# EAGLE design EvalBoard (EAGLE 7.4.0)
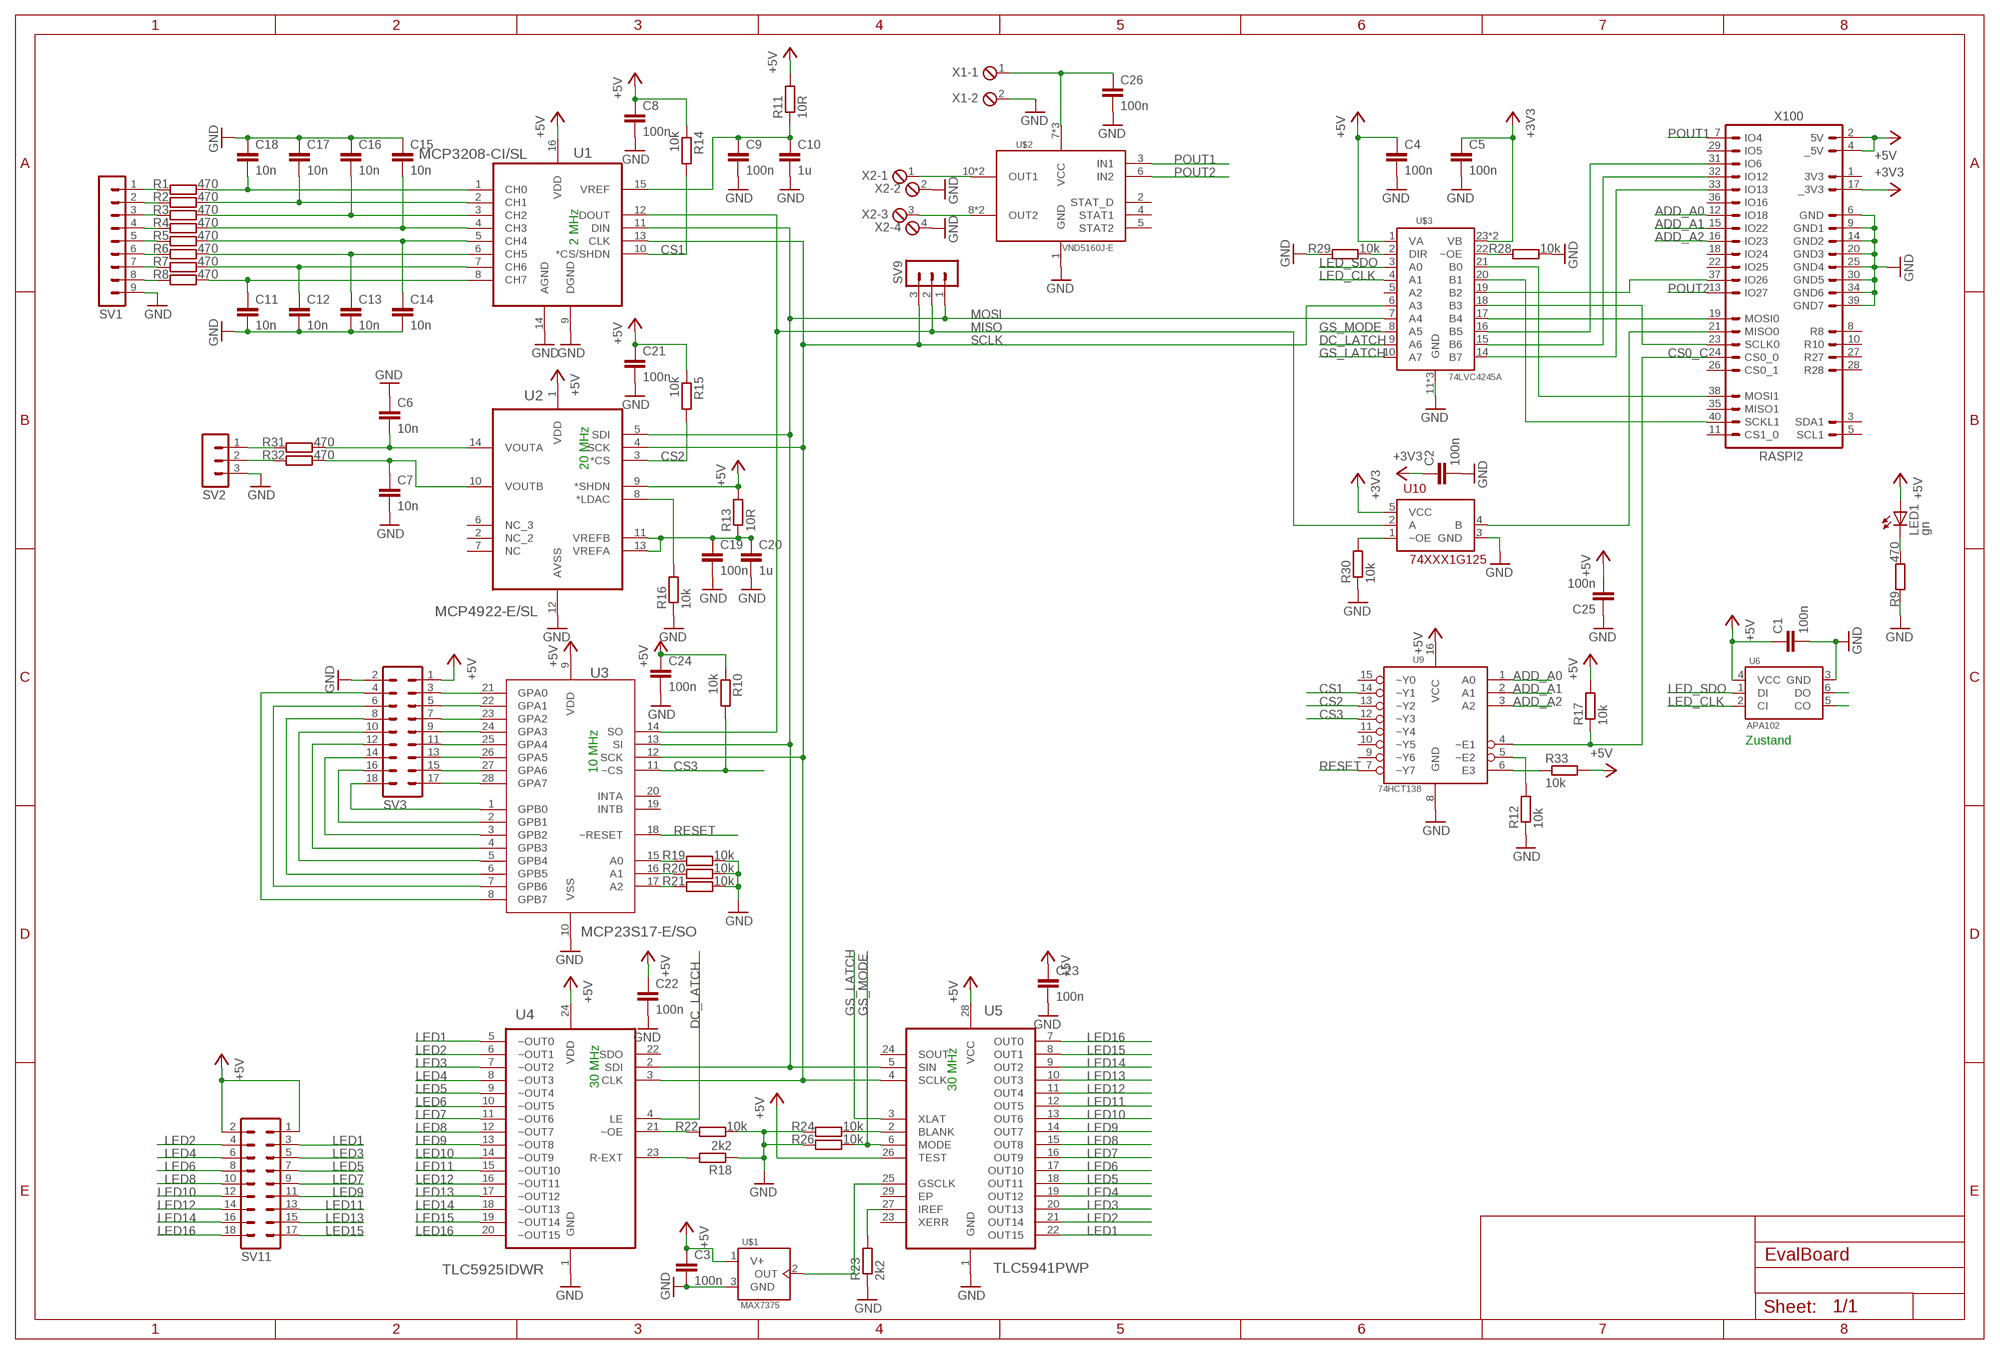
[diagram p0: schematic, sheet 1]

## Parts
C1  100n  C-EUC0805  [C0805]
C2  100n  C-EUC0805  [C0805]
C3  100n  C-EUC0805  [C0805]
C4  100n  C-EUC0805  [C0805]
C5  100n  C-EUC0805  [C0805]
C6  10n  C-EUC0805  [C0805]
C7  10n  C-EUC0805  [C0805]
C8  100n  C-EUC0805  [C0805]
C9  100n  C-EUC0805  [C0805]
C10  1u  C-EUC0805  [C0805]
C11  10n  C-EUC0805  [C0805]
C12  10n  C-EUC0805  [C0805]
C13  10n  C-EUC0805  [C0805]
C14  10n  C-EUC0805  [C0805]
C15  10n  C-EUC0805  [C0805]
C16  10n  C-EUC0805  [C0805]
C17  10n  C-EUC0805  [C0805]
C18  10n  C-EUC0805  [C0805]
C19  100n  C-EUC0805  [C0805]
C20  1u  C-EUC0805  [C0805]
C21  100n  C-EUC0805  [C0805]
C22  100n  C-EUC0805  [C0805]
C23  100n  C-EUC0805  [C0805]
C24  100n  C-EUC0805  [C0805]
C25  100n  C-EUC0805  [C0805]
C26  100n  C-EUC0805  [C0805]
LED1  gn  LED5MM  [LED5MM]
R1  470  R-EU_R0805  [R0805]
R2  470  R-EU_R0805  [R0805]
R3  470  R-EU_R0805  [R0805]
R4  470  R-EU_R0805  [R0805]
R5  470  R-EU_R0805  [R0805]
R6  470  R-EU_R0805  [R0805]
R7  470  R-EU_R0805  [R0805]
R8  470  R-EU_R0805  [R0805]
R9  470  R-EU_R0805  [R0805]
R10  10k  R-EU_R0805  [R0805]
R11  10R  R-EU_R0805  [R0805]
R12  10k  R-EU_R0805  [R0805]
R13  10R  R-EU_R0805  [R0805]
R14  10k  R-EU_R0805  [R0805]
R15  10k  R-EU_R0805  [R0805]
R16  10k  R-EU_R0805  [R0805]
R17  10k  R-EU_R0805  [R0805]
R18  2k2  R-EU_R0805  [R0805]
R19  10k  R-EU_R0805  [R0805]
R20  10k  R-EU_R0805  [R0805]
R21  10k  R-EU_R0805  [R0805]
R22  10k  R-EU_R0805  [R0805]
R23  2k2  R-EU_R0805  [R0805]
R24  10k  R-EU_R0805  [R0805]
R26  10k  R-EU_R0805  [R0805]
R28  10k  R-EU_R0805  [R0805]
R29  10k  R-EU_R0805  [R0805]
R30  10k  R-EU_R0805  [R0805]
R31  470  R-EU_R0805  [R0805]
R32  470  R-EU_R0805  [R0805]
R33  10k  R-EU_R0805  [R0805]
SV1  MA09-1W  [MA09-1W]
SV2  MA03-1  [MA03-1]
SV3  MA09-2W  [MA09-2W]
SV9  MA03-1  [MA03-1]
SV11  MA09-2W  [MA09-2W]
U1  MCP3208-CI/SL  [SOIC127P600X175-16N]
U2  MCP4922-E/SL  [SOIC127P600X175-14N]
U3  MCP23S17-E/SO  [SOIC127P030X265-28N]
U4  TLC5925IDWR  [SOIC127P1030X265-24N]
U5  TLC5941PWP  [SOP65P640X120-29N]
U6  APA102  [LED5050PACK]
U9  74HCT138  [SOIC127P600X175-16N]
U10  74XXX1G125  [SOT23-5L]
U$1  MAX7375  [SC70]
U$2  VND5160J-E  [POWERSSO12]
U$3  74LVC4245A  [SOIC127P1030X265-24N]
X1  MPT2  [2POL254]
X2  MPT4  [4POL254]
X100  RASPI2  [ML40]

## Nets
+3V3: C2.1 C5.1 U10.5(VCC) U$3.23(VB) U$3.24(VB) X100.17(_3V3)
+5V: C1.1 C3.1 C4.1 C8.1 C21.1 C22.1 C23.1 C24.1 C25.2 LED1.A R10.1 R11.2 R13.2 R14.1 R15.1 R17.2 R33.2 SV3.1 SV11.1 SV11.2 U1.16(VDD) U2.1(VDD) U2.9(*SHDN) U3.9(VDD) U4.24(VDD) U5.26(TEST) U5.28(VCC) U6.4(VCC) U9.16(VCC) U$1.1(V+) U$3.1(VA) X100.2(5V) X100.4(_5V)
ADD_A0: U9.1(A0) X100.12(IO18)
ADD_A1: U9.2(A1) X100.15(IO22)
ADD_A2: U9.3(A2) X100.16(IO23)
CS0_C: R17.1 U9.4(~E1) X100.24(CS0_0)
CS1: R14.2 U1.10(*CS/SHDN) U9.14(~Y1)
CS2: R15.2 U2.3(*CS) U9.13(~Y2)
CS3: R10.2 U3.11(~CS) U9.12(~Y3)
DC_LATCH: U4.4(LE) U$3.9(A6)
GND: C1.2 C2.2 C3.2 C4.2 C5.2 C6.1 C7.2 C8.2 C9.2 C10.2 C11.2 C12.2 C13.2 C14.2 C15.1 C16.1 C17.1 C18.1 C19.2 C20.2 C21.2 C22.2 C23.2 C24.2 C25.1 C26.2 R9.1 R12.1 R16.1 R18.1 R19.2 R20.2 R21.2 R22.2 R23.1 R24.1 R26.1 R28.2 R29.1 R30.1 SV1.9 SV2.3 SV3.2 U1.9(DGND) U1.14(AGND) U2.12(AVSS) U3.10(VSS) U4.1(GND) U5.1(GND) U6.3(GND) U9.8(GND) U10.3(GND) U$1.3(GND) U$2.1(GND) U$3.11(GND) U$3.12(GND) U$3.13(GND) X1.2 X2.2 X2.4 X100.6(GND) X100.9(GND1) X100.14(GND2) X100.20(GND3) X100.25(GND4) X100.30(GND5) X100.34(GND6) X100.39(GND7)
GS_LATCH: U5.3(XLAT) U$3.10(A7)
GS_MODE: R26.2 U5.6(MODE) U$3.8(A5)
LED1: SV11.3 U4.5(~OUT0) U5.22(OUT15)
LED2: SV11.4 U4.6(~OUT1) U5.21(OUT14)
LED3: SV11.5 U4.7(~OUT2) U5.20(OUT13)
LED4: SV11.6 U4.8(~OUT3) U5.19(OUT12)
LED5: SV11.7 U4.9(~OUT4) U5.18(OUT11)
LED6: SV11.8 U4.10(~OUT5) U5.17(OUT10)
LED7: SV11.9 U4.11(~OUT6) U5.16(OUT9)
LED8: SV11.10 U4.12(~OUT7) U5.15(OUT8)
LED9: SV11.11 U4.13(~OUT8) U5.14(OUT7)
LED10: SV11.12 U4.14(~OUT9) U5.13(OUT6)
LED11: SV11.13 U4.15(~OUT10) U5.12(OUT5)
LED12: SV11.14 U4.16(~OUT11) U5.11(OUT4)
LED13: SV11.15 U4.17(~OUT12) U5.10(OUT3)
LED14: SV11.16 U4.18(~OUT13) U5.9(OUT2)
LED15: SV11.17 U4.19(~OUT14) U5.8(OUT1)
LED16: SV11.18 U4.20(~OUT15) U5.7(OUT0)
LED_CLK: U6.2(CI) U$3.4(A1)
LED_SDO: U6.1(DI) U$3.3(A0)
MISO: SV9.2 U1.12(DOUT) U3.14(SO) U10.2(A)
MISO0: U10.4(B) X100.21(MISO0)
MOSI: SV9.1 U1.11(DIN) U2.5(SDI) U3.13(SI) U4.2(SDI) U5.5(SIN) U$3.7(A4)
MOSI0: U$3.17(B4) X100.19(MOSI0)
MOSI1: U$3.21(B0) X100.38(MOSI1)
N$1: R1.1 SV1.1
N$2: R2.1 SV1.2
N$3: R3.1 SV1.3
N$4: R4.1 SV1.4
N$5: R5.1 SV1.5
N$6: R6.1 SV1.6
N$7: R7.1 SV1.7
N$8: R8.1 SV1.8
N$9: C18.2 R1.2 U1.1(CH0)
N$10: C17.2 R2.2 U1.2(CH1)
N$11: C16.2 R3.2 U1.3(CH2)
N$12: C15.2 R4.2 U1.4(CH3)
N$13: C14.1 R5.2 U1.5(CH4)
N$14: C13.1 R6.2 U1.6(CH5)
N$15: C12.1 R7.2 U1.7(CH6)
N$16: C11.1 R8.2 U1.8(CH7)
N$17: C6.2 R31.2 U2.14(VOUTA)
N$18: R33.1 U9.6(E3)
N$35: R30.2 U10.1(~OE)
N$36: U$3.19(B2) X100.37(IO26)
N$37: R31.1 SV2.1
N$38: R32.1 SV2.2
N$39: C7.1 R32.2 U2.10(VOUTB)
N$42: U$3.16(B5) X100.31(IO6)
N$43: LED1.K(C) R9.2
N$44: U$2.8(OUT2) U$2.9(OUT2) X2.3
N$67: U$2.10(OUT1) U$2.11(OUT1) X2.1
N$72: U6.6(DO)
N$73: U6.5(CO)
N$76: C9.1 C10.1 R11.1 U1.15(VREF)
N$77: C19.1 C20.1 R13.1 U2.11(VREFB) U2.13(VREFA)
N$78: R16.2 U2.8(*LDAC)
N$80: R18.2 U4.23(R-EXT)
N$81: U5.25(GSCLK) U$1.2(OUT)
N$82: U$3.15(B6) X100.32(IO12)
N$83: R19.1 U3.15(A0)
N$84: R20.1 U3.16(A1)
N$85: R21.1 U3.17(A2)
N$86: U$3.14(B7) X100.33(IO13)
N$89: R22.1 U4.21(~OE)
N$90: R12.2 U9.5(~E2)
N$93: R23.2 U5.27(IREF)
N$94: R24.2 U5.2(BLANK)
N$98: R28.1 U$3.22(~OE)
N$99: R29.2 U$3.2(DIR)
PA0: SV3.3 U3.21(GPA0)
PA1: SV3.5 U3.22(GPA1)
PA2: SV3.7 U3.23(GPA2)
PA3: SV3.9 U3.24(GPA3)
PA4: SV3.11 U3.25(GPA4)
PA5: SV3.13 U3.26(GPA5)
PA6: SV3.15 U3.27(GPA6)
PA7: SV3.17 U3.28(GPA7)
PB0: SV3.18 U3.1(GPB0)
PB1: SV3.16 U3.2(GPB1)
PB2: SV3.14 U3.3(GPB2)
PB3: SV3.12 U3.4(GPB3)
PB4: SV3.10 U3.5(GPB4)
PB5: SV3.8 U3.6(GPB5)
PB6: SV3.6 U3.7(GPB6)
PB7: SV3.4 U3.8(GPB7)
POUT1: U$2.3(IN1) X100.7(IO4)
POUT2: U$2.6(IN2) X100.13(IO27)
RESET: U3.18(~RESET) U9.7(~Y7)
SCLK: SV9.3 U1.13(CLK) U2.4(SCK) U3.12(SCK) U4.3(CLK) U5.4(SCLK) U$3.6(A3)
SCLK0: U$3.18(B3) X100.23(SCLK0)
SCLK1: U$3.20(B1) X100.40(SCKL1)
VCC: C26.1 U$2.7(VCC) U$2.12(VCC) U$2.TP(VCC) X1.1
Unconnected: U2.2(NC_2) U2.6(NC_3) U2.7(NC) U3.19(INTB) U3.20(INTA) U4.22(SDO) U5.23(XERR) U5.24(SOUT) U5.29(EP) U9.9(~Y6) U9.10(~Y5) U9.11(~Y4) U9.15(~Y0) U$2.2(STAT_D) U$2.4(STAT1) U$2.5(STAT2) U$3.5(A2) X100.1(3V3) X100.3(SDA1) X100.5(SCL1) X100.8(R8) X100.10(R10) X100.11(CS1_0) X100.18(IO24) X100.22(IO25) X100.26(CS0_1) X100.27(R27) X100.28(R28) X100.29(IO5) X100.35(MISO1) X100.36(IO16)

## Notes on the sheet
- 2 MHz
- 20 MHz
- Zustand
- 10 MHz
- 30 MHz
- 30 MHz

## Library data of the parts
C1-C26 = rcl:C-EU: CAPACITOR, European symbol
LED1 = led:LED: LED OSRAM: - CHIPLED LG R971, LG N971, LY N971, LG Q971, LY Q971, LO R971, LY R971 LH N974, LH R974 LS Q976, LO Q976, LY Q976 LO Q996 - Hyper CHIPLED LW Q18S LB Q993, LB Q99A, LB R99A - SideLED LS A670, LO A670, LY A670, LG A670, LP A670 LB A673, LV A673, LT A673, LW A673 LH A674 LY A675 LS A676, LA A676, LO A676, LY A676, LW A676 LS A679, LY A679, LG A679 - Hyper Micro SIDELED® LS Y876, LA Y876, LO Y876, LY Y876 LT Y87S - SmartLED LW L88C, LW L88S LB L89C, LB L89S, LG L890 LS L89K, LO L89K, LY L89K LS L896, LA L896, LO L896, LY L896 - TOPLED LS T670, LO T670, LY T670, LG T670, LP T670 LSG T670, LSP T670, LSY T670, LOP T670, LYG T670 LG T671, LOG T671, LSG T671 LB T673, LV T673, LT T673, LW T673 LH T674 LS T676, LA T676, LO T676, LY T676, LB T676, LH T676, LSB T676, LW T676 LB T67C, LV T67C, LT T67C, LS T67K, LO T67K, LY T67K, LW E67C LS E67B, LA E67B, LO E67B, LY E67B, LB E67C, LV E67C, LT E67C LW T67C LS T679, LY T679, LG T679 LS T770, LO T770, LY T770, LG T770, LP T770 LB T773, LV T773, LT T773, LW T773 LH T774 LS E675, LA E675, LY E675, LS T675 LS T776, LA T776, LO T776, LY T776, LB T776 LHGB T686 LT T68C, LB T68C - Hyper Mini TOPLED® LB M676 - Mini TOPLED Santana® LG M470 LS M47K, LO M47K, LY M47K Source: http://www.osram.convergy.de LUXEON: - LUMILED® LXK2-PW12-R00, LXK2-PW12-S00, LXK2-PW14-U00, LXK2-PW14-V00 LXK2-PM12-R00, LXK2-PM12-S00, LXK2-PM14-U00 LXK2-PE12-Q00, LXK2-PE12-R00, LXK2-PE12-S00, LXK2-PE14-T00, LXK2-PE14-U00 LXK2-PB12-K00, LXK2-PB12-L00, LXK2-PB12-M00, LXK2-PB14-N00, LXK2-PB14-P00, LXK2-PB14-Q00 LXK2-PR12-L00, LXK2-PR12-M00, LXK2-PR14-Q00, LXK2-PR14-R00 LXK2-PD12-Q00, LXK2-PD12-R00, LXK2-PD12-S00 LXK2-PH12-R00, LXK2-PH12-S00 LXK2-PL12-P00, LXK2-PL12-Q00, LXK2-PL12-R00 Source: www.luxeon.com KINGBRIGHT: KA-3528ASYC Source: www.kingbright.com
R1-R24 R26 R28-R33 = rcl:R-EU_: RESISTOR, European symbol
SV1 = con-lstb:MA09-1W: PIN HEADER; OC_FARNELL: unknown; OC_NEWARK: unknown
SV2 SV9 = con-lstb:MA03-1: PIN HEADER; OC_FARNELL: unknown; OC_NEWARK: unknown
SV3 SV11 = con-lstb:MA09-2W: PIN HEADER; OC_FARNELL: unknown; OC_NEWARK: unknown
U1 = Z_GessIOMod:MCP3208-CI/SL: IC, 12 ADC, SMD, 3208; MPN: MCP3208-CI/SL; OC_FARNELL: 1084270; OC_NEWARK: 69K7605; PACKAGE: SOIC16; SUPPLIER: Microchip
U2 = Z_GessIOMod:MCP4922-E/SL: IC, 12BIT DAC DUAL, SPI I/F; MPN: MCP4922-E/SL; OC_FARNELL: 1332114; OC_NEWARK: 08J8748; PACKAGE: SOIC14; SUPPLIER: Microchip
U3 = Z_GessIOMod:MCP23S17-E/SO: 16-Bit I/O Expander; DESCRIPTION: IC I/O EXPANDER; MPN: MCP23S17-E/SO; OC_FARNELL: 1332093; OC_NEWARK: 31K2950; PACKAGE: SOIC-28; SUPPLIER: Microchip
U4 = Z_GessIOMod:TLC5925IDWR: LOW-POWER 16-CHANNEL CONSTANT-CURRENT LED SINK DRIVER; MPN: TLC5925IDWR; OC_FARNELL: 1858096; OC_NEWARK: 10R6961; PACKAGE: SOIC-24; SUPPLIER: Texas Instruments
U5 = Z_GessIOMod:TLC5941PWP: 16-CHANNEL LED DRIVER WITH DOT CORRECTION AND GRAYSCALE PWM CONTROL; MPN: TLC5941PWP; OC_FARNELL: 1226308; OC_NEWARK: 58K6744; PACKAGE: HTSSOP-28; SUPPLIER: Texas Instruments
U6 = Z_GessIOMod:APA102
U9 = Z_GessIOMod:74HCT138
U10 = Z_GessIOMod:74XXX1G125
U$1 = Z_GessIOMod:MAX7375
U$2 = Z_GessIOMod:VND5160J-E
U$3 = Z_GessIOMod:74LVC4245A
X1 = con-phoenix-254:MPT2: PHOENIX CONNECTOR; OC_FARNELL: unknown; OC_NEWARK: unknown
X2 = con-phoenix-254:MPT4: PHOENIX CONNECTOR; OC_FARNELL: unknown; OC_NEWARK: unknown
X100 = Z_GessIOMod:RASPI2

## Board
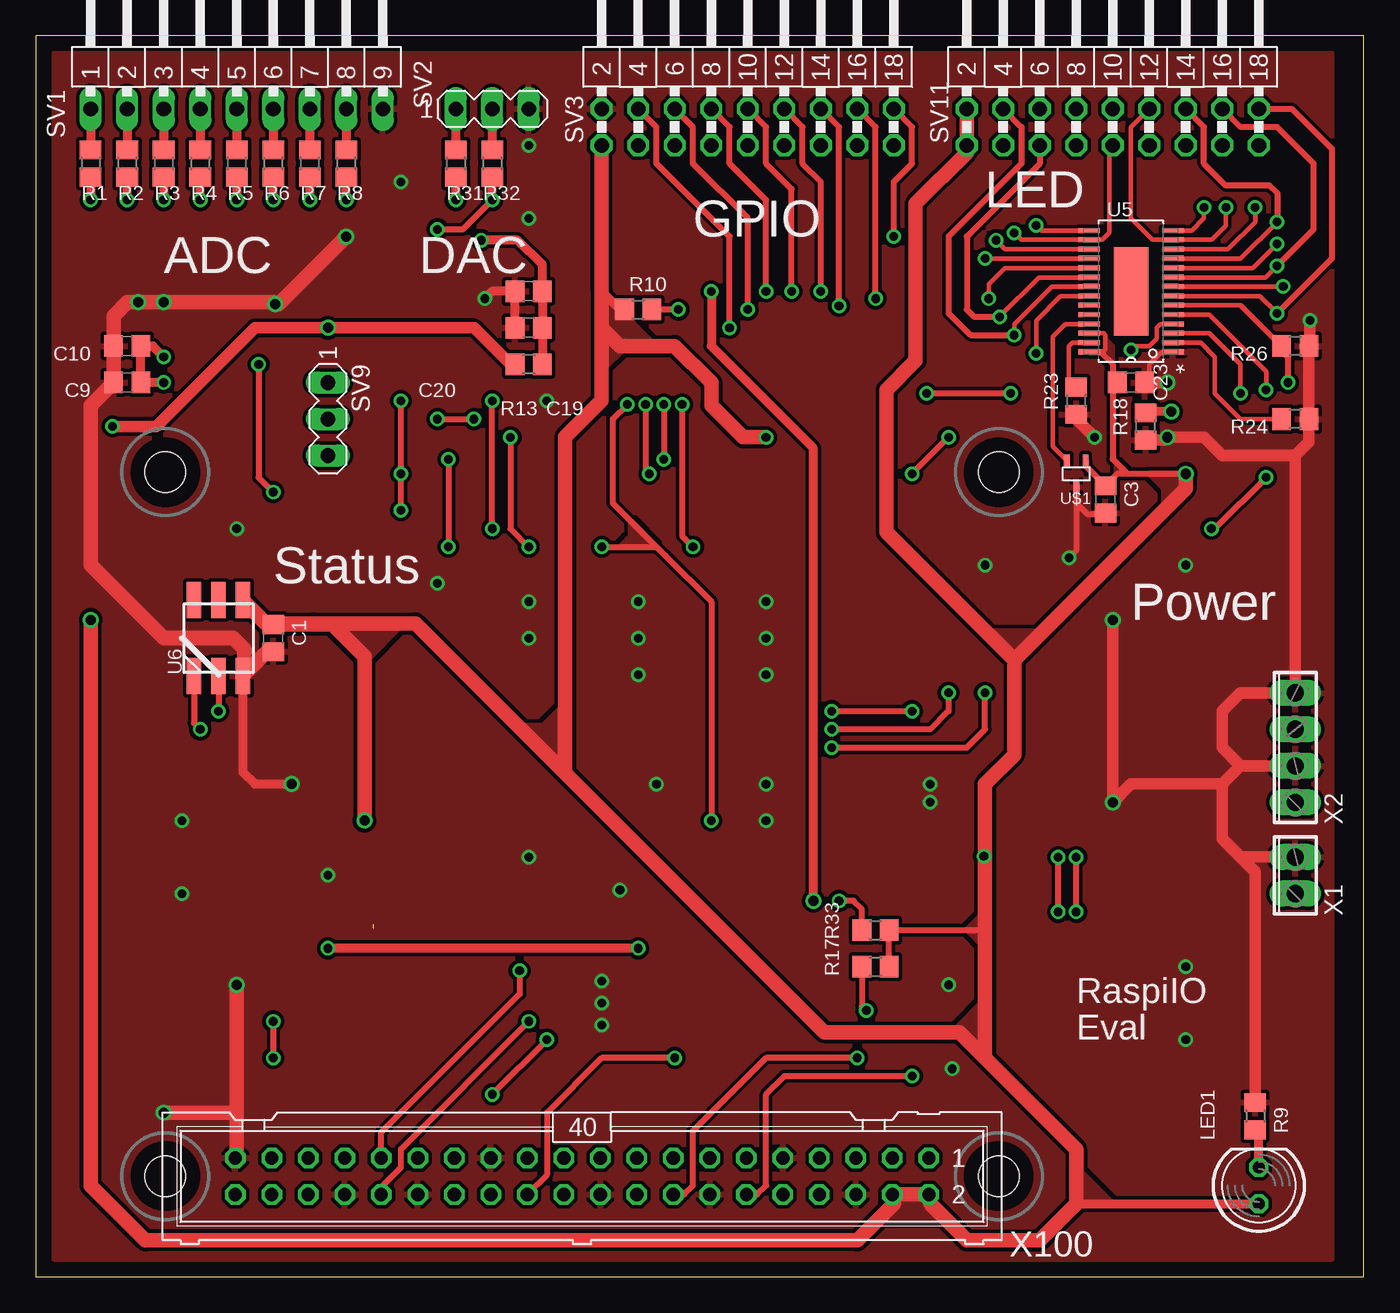
[diagram p1: board, top side]
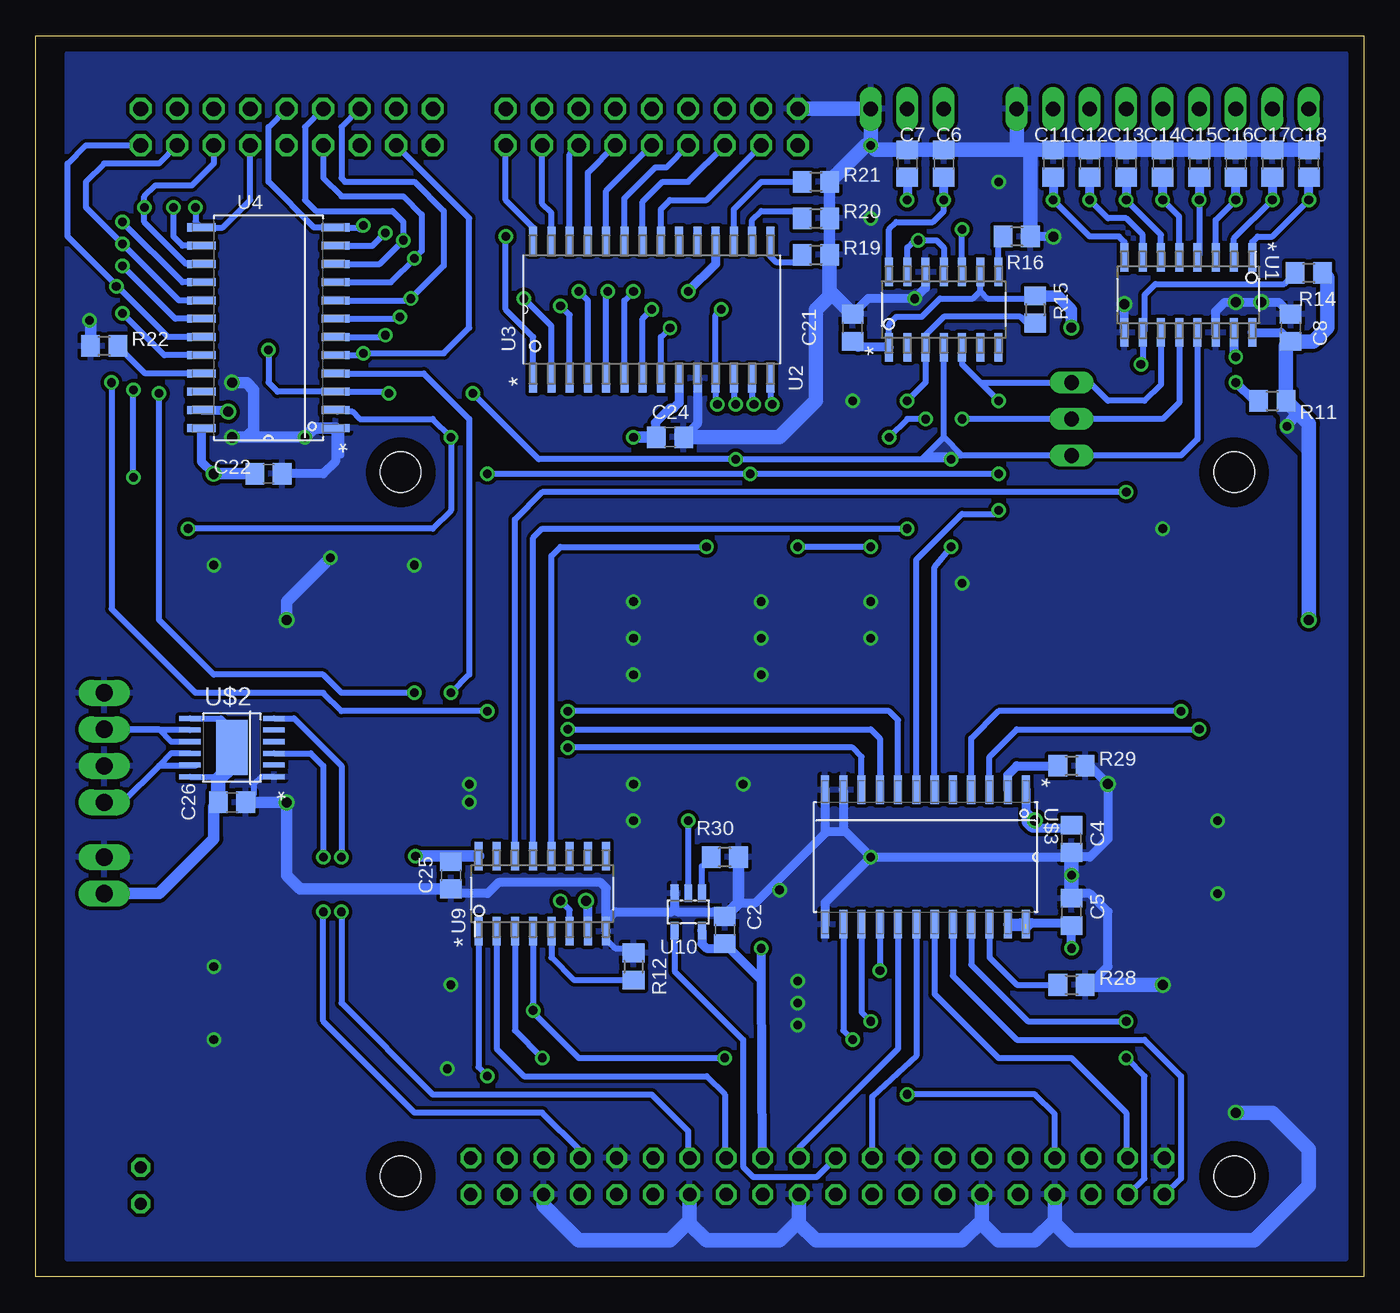
[diagram p2: board, bottom side, seen from below]

Size 92.38 x 86.35 mm. Coordinates in mm from the lower left corner, seen from the top.
Outline: 0,0 92.38,0 92.38,86.35 0,86.35 0,0
Copper layers (1*16): Top 0.035mm / dielectric 1.5mm / Bottom 0.035mm
Design rules "default *": minimum track width 10mil, minimum drill 23mil, track to track 10mil, track to pad 10mil, pad to pad 10mil, via to via 10mil, smd to smd 8mil, copper to edge 40mil, drill to drill 8mil, minimum pad ring 10mil, minimum via ring 8mil, stop-mask expansion 4mil, vias tented up to drill 0mil, thermal gap 10mil
Holes 2.8 mm at 9,7 67,7 9,56 67,56

### Footprints (pad centres in the part's own frame; a part is rotated, then mirrored left to right if it is on the bottom)
C0805 = smd 1.3 x 1.5: 1 -0.95,0; 2 0.95,0
LED5MM = drill 0.813 octagon: A -1.27,0; K 1.27,0
R0805 = smd 1.3 x 1.5: 1 -0.95,0; 2 0.95,0
MA09-1W = drill 1.016 long: 1 -10.16,0; 2 -7.62,0; 3 -5.08,0; 4 -2.54,0; 5 0,0; 6 2.54,0; 7 5.08,0; 8 7.62,0; 9 10.16,0
MA03-1 = drill 1.016 long: 1 -2.54,0; 2 0,0; 3 2.54,0
MA09-2W = drill 1.016 octagon: 1 -10.16,-1.27; 2 -10.16,1.27; 3 -7.62,-1.27; 4 -7.62,1.27; 5 -5.08,-1.27; 6 -5.08,1.27; 7 -2.54,-1.27; 8 -2.54,1.27; 9 0,-1.27; 10 0,1.27; 11 2.54,-1.27; 12 2.54,1.27; 13 5.08,-1.27; 14 5.08,1.27; 15 7.62,-1.27; 16 7.62,1.27; 17 10.16,-1.27; 18 10.16,1.27
SOIC127P600X175-16N = smd 1.981 x 0.559: 1 -2.616,4.445; 2 -2.616,3.175; 3 -2.616,1.905; 4 -2.616,0.635; 5 -2.616,-0.635; 6 -2.616,-1.905; 7 -2.616,-3.175; 8 -2.616,-4.445; 9 2.616,-4.445; 10 2.616,-3.175; 11 2.616,-1.905; 12 2.616,-0.635; 13 2.616,0.635; 14 2.616,1.905; 15 2.616,3.175; 16 2.616,4.445
SOIC127P600X175-14N = smd 1.981 x 0.559: 1 -2.616,3.81; 2 -2.616,2.54; 3 -2.616,1.27; 4 -2.616,0; 5 -2.616,-1.27; 6 -2.616,-2.54; 7 -2.616,-3.81; 8 2.616,-3.81; 9 2.616,-2.54; 10 2.616,-1.27; 11 2.616,0; 12 2.616,1.27; 13 2.616,2.54; 14 2.616,3.81
SOIC127P030X265-28N = smd 1.981 x 0.559: 1 -4.775,8.255; 2 -4.775,6.985; 3 -4.775,5.715; 4 -4.775,4.445; 5 -4.775,3.175; 6 -4.775,1.905; 7 -4.775,0.635; 8 -4.775,-0.635; 9 -4.775,-1.905; 10 -4.775,-3.175; 11 -4.775,-4.445; 12 -4.775,-5.715; 13 -4.775,-6.985; 14 -4.775,-8.255; 15 4.775,-8.255; 16 4.775,-6.985; 17 4.775,-5.715; 18 4.775,-4.445; 19 4.775,-3.175; 20 4.775,-1.905; 21 4.775,-0.635; 22 4.775,0.635; 23 4.775,1.905; 24 4.775,3.175; 25 4.775,4.445; 26 4.775,5.715; 27 4.775,6.985; 28 4.775,8.255
SOIC127P1030X265-24N = smd 1.981 x 0.559: 1 -4.674,6.985; 2 -4.674,5.715; 3 -4.674,4.445; 4 -4.674,3.175; 5 -4.674,1.905; 6 -4.674,0.635; 7 -4.674,-0.635; 8 -4.674,-1.905; 9 -4.674,-3.175; 10 -4.674,-4.445; 11 -4.674,-5.715; 12 -4.674,-6.985; 13 4.674,-6.985; 14 4.674,-5.715; 15 4.674,-4.445; 16 4.674,-3.175; 17 4.674,-1.905; 18 4.674,-0.635; 19 4.674,0.635; 20 4.674,1.905; 21 4.674,3.175; 22 4.674,4.445; 23 4.674,5.715; 24 4.674,6.985
SOP65P640X120-29N = smd 1.473 x 0.356: 1 -2.921,4.216; 2 -2.921,3.581; 3 -2.921,2.921; 4 -2.921,2.286; 5 -2.921,1.626; 6 -2.921,0.965; 7 -2.921,0.33; 8 -2.921,-0.33; 9 -2.921,-0.965; 10 -2.921,-1.626; 11 -2.921,-2.286; 12 -2.921,-2.921; 13 -2.921,-3.581; 14 -2.921,-4.216; 15 2.921,-4.216; 16 2.921,-3.581; 17 2.921,-2.921; 18 2.921,-2.286; 19 2.921,-1.626; 20 2.921,-0.965; 21 2.921,-0.33; 22 2.921,0.33; 23 2.921,0.965; 24 2.921,1.626; 25 2.921,2.286; 26 2.921,2.921; 27 2.921,3.581; 28 2.921,4.216 | smd 2.388 x 6.172: 29 0,0
LED5050PACK = smd 2.5 x 1: 1 -2.65,1.7; 2 -2.65,0; 3 -2.65,-1.7; 4 2.65,-1.7; 5 2.65,0; 6 2.65,1.7
SOT23-5L = smd 0.55 x 1.2: 1 -0.95,-1.3; 2 0,-1.3; 3 0.95,-1.3; 4 0.95,1.3; 5 -0.95,1.3
SC70 = smd 0.406 x 0.813: 1 -0.65,-0.925; 2 0.65,-0.925; 3 0,0.925
POWERSSO12 = smd 1.473 x 0.356: 1 -2.921,2.032; 2 -2.921,1.219; 3 -2.921,0.406; 4 -2.921,-0.406; 5 -2.921,-1.219; 6 -2.921,-2.032; 7 2.921,-2.032; 8 2.921,-1.219; 9 2.921,-0.406; 10 2.921,0.406; 11 2.921,1.219; 12 2.921,2.032 | smd 2.184 x 3.81: TP 0,0
2POL254 = drill 1.2 long: 1 -1.27,0; 2 1.27,0
4POL254 = drill 1.2 long: 1 -3.81,0; 2 -1.27,0; 3 1.27,0; 4 3.81,0
ML40 = drill 0.914 octagon: 1 -24.13,-1.27; 2 -24.13,1.27; 3 -21.59,-1.27; 4 -21.59,1.27; 5 -19.05,-1.27; 6 -19.05,1.27; 7 -16.51,-1.27; 8 -16.51,1.27; 9 -13.97,-1.27; 10 -13.97,1.27; 11 -11.43,-1.27; 12 -11.43,1.27; 13 -8.89,-1.27; 14 -8.89,1.27; 15 -6.35,-1.27; 16 -6.35,1.27; 17 -3.81,-1.27; 18 -3.81,1.27; 19 -1.27,-1.27; 20 -1.27,1.27; 21 1.27,-1.27; 22 1.27,1.27; 23 3.81,-1.27; 24 3.81,1.27; 25 6.35,-1.27; 26 6.35,1.27; 27 8.89,-1.27; 28 8.89,1.27; 29 11.43,-1.27; 30 11.43,1.27; 31 13.97,-1.27; 32 13.97,1.27; 33 16.51,-1.27; 34 16.51,1.27; 35 19.05,-1.27; 36 19.05,1.27; 37 21.59,-1.27; 38 21.59,1.27; 39 24.13,-1.27; 40 24.13,1.27

### Placement (x,y rotation side)
C1  16.51,44.45 270 top
C2  44.45,24.13 90 bottom
C3  74.42,54.1 270 top
C4  20.32,30.48 270 bottom
C5  20.32,25.4 90 bottom
C6  29.21,77.47 270 bottom
C7  31.75,77.47 90 bottom
C8  5.08,66.04 90 bottom
C9  6.35,62.23 180 top
C10  6.35,64.77 180 top
C11  21.59,77.47 90 bottom
C12  19.05,77.47 90 bottom
C13  16.51,77.47 90 bottom
C14  13.97,77.47 90 bottom
C15  11.43,77.47 270 bottom
C16  8.89,77.47 270 bottom
C17  6.35,77.47 270 bottom
C18  3.81,77.47 270 bottom
C19  34.29,66.04 180 top
C20  34.29,68.58 180 top
C21  35.56,66.04 90 bottom
C22  76.2,55.88 0 bottom
C23  76.2,62.23 0 top
C24  48.26,58.42 0 bottom
C25  63.5,27.94 90 bottom
C26  78.74,33.02 0 bottom
LED1  85.09,6.35 90 top
R1  3.81,77.47 270 top
R2  6.35,77.47 270 top
R3  8.89,77.47 270 top
R4  11.43,77.47 270 top
R5  13.97,77.47 270 top
R6  16.51,77.47 270 top
R7  19.05,77.47 270 top
R8  21.59,77.47 270 top
R9  84.84,11.18 270 top
R10  41.91,67.31 0 top
R11  6.35,60.96 0 bottom
R12  50.8,21.59 270 bottom
R13  34.29,63.5 180 top
R14  3.81,69.85 180 bottom
R15  22.86,67.31 270 bottom
R16  24.13,72.39 180 bottom
R17  58.42,21.59 0 top
R18  77.22,59.18 90 top
R19  38.1,71.12 0 bottom
R20  38.1,73.66 0 bottom
R21  38.1,76.2 0 bottom
R22  87.63,64.77 180 bottom
R23  72.39,60.96 90 top
R24  87.63,59.69 180 top
R26  87.63,64.77 180 top
R28  20.32,20.32 0 bottom
R29  20.32,35.56 180 bottom
R30  44.45,29.21 180 bottom
R31  29.21,77.47 270 top
R32  31.75,77.47 270 top
R33  58.42,24.13 0 top
SV1  13.97,81.28 0 top
SV2  31.75,81.28 0 top
SV3  49.53,80.01 0 top
SV9  20.32,59.69 270 top
SV11  74.93,80.01 0 top
U1  12.19,68.33 270 bottom
U2  29.21,67.31 90 bottom
U3  49.53,67.31 90 bottom
U4  76.2,66.04 180 bottom
U5  76.2,68.58 180 top
U6  12.7,44.45 90 top
U9  57.15,26.67 90 bottom
U10  46.99,25.4 180 bottom
U$1  72.39,55.88 180 top
U$2  78.74,36.83 180 bottom
U$3  30.48,29.21 270 bottom
X1  87.63,27.94 90 top
X2  87.63,36.83 90 top
X100  38,7 180 top

### Tracks (layer width: path | path; a pad name or v marks a point on that pad's centre or on a via)
+3V3  (via drill 0.6)  (1 unrouted)
  Top 0.61: v41.91,22.86 v20.32,22.86
  Bottom 0.406: 23.5,24.26 24.49,24.26 U$3.23
  Bottom 0.61: 24.77,24.51 24.64,24.64 23.88,24.64 23.5,24.26 23.11,24.64 20.51,24.64 C5.1 v20.32,22.86 | U10.5 46.04,23.18 45.72,22.86 44.77,22.86 C2.1 41.91,20.64 | X100.17 41.91,20.64 | 41.91,20.64 v41.91,22.86
+5V  (via drill 0.6, 0.7)
  Top 0.305: 74.27,64.36 74.42,64.52 74.42,65.53 74.3,65.66 U5.26
  Top 0.406: 74.93,62.55 74.93,63.5 74.07,64.36 U5.28 74.27,64.36 | 74.93,62.55 C23.1 | 66.04,24.13 R33.2 R17.2 | 75.95,55.88 v80.01,55.88 | 75.95,55.88 75.25,55.88 C3.1 73.04,56.43 U$1.1 | 74.93,62.55 74.93,56.9 75.95,55.88
  Top 0.61: R10.1 40.64,67.31 39.37,68.58 | 72.39,5.08 LED1.A
  Top 0.813: v65.96,29.29 65.96,34.21 66.04,34.29 | v5.33,59.18 8.38,59.18 15.24,66.04 v20.32,66.04 30.48,66.04 33.02,63.5 R13.2
  Top 1.016: SV11.2 SV11.1 64.77,78.23 61.21,74.68 61.21,63.75 59.18,61.72 59.18,51.82 68.07,42.93 | v3.81,45.72 3.81,6.35 7.62,2.54 57.15,2.54 59.69,5.08 X100.4 X100.2 62.23,5.08 64.77,2.54 69.85,2.54 72.39,5.08 72.39,8.89 66.04,15.24 | 20.64,45.4 C1.1 16.1,45.4 U6.4 14.4,47.07 16,45.47 26.42,45.47 36.83,35.05 | v22.86,31.75 22.86,43.18 20.64,45.4 | 20.64,45.4 19.3,45.47 | 66.04,15.24 66.04,24.13 66.04,34.29 68.07,36.32 68.07,42.93 | v80.01,55.88 80.01,54.86 68.07,42.93 | SV3.1 39.37,68.58 39.37,66.04 | 39.37,66.04 40.64,64.77 44.45,64.77 46.99,62.23 46.99,60.64 C24.1 v50.8,58.42 | 36.83,35.05 54.86,17.02 64.26,17.02 66.04,15.24 | 39.37,66.04 39.37,60.96 36.83,58.42 36.83,35.05
  Bottom 0.406: U2.1 33.02,66.29 32.51,66.8 30.73,66.8 29.46,68.07 27.18,68.07 26.67,68.58 | 26.67,68.58 U2.9 | 26.67,68.58 26.16,68.07 23.05,68.07 R15.1
  Bottom 0.61: U1.16 5.73,65.71 C8.1 | U2.1 35.16,64.69 C21.1 | U3.9 47.62,60.83 48.01,60.45 48.26,60.45 49.28,59.44 49.28,58.49 C24.1 | v80.01,55.88 80.87,56.74 U4.24 | C4.1 20.51,31.24 23.11,31.24 23.5,31.62 U$3.1 23.5,32.38 v22.86,31.75 | U9.16 63.1,29.29 C25.2
  Bottom 0.813: v80.01,55.88 C22.1 | v50.8,58.42 C24.1 | U9.16 v65.96,29.29 | v5.33,59.18 4.61,60.16 | R15.1 21.27,68.26 20.32,67.31 v20.32,66.04
  Bottom 1.016: 35.63,65.02 C21.1 | v3.81,45.72 3.81,59.37 4.61,60.16 R11.2 5.4,64.77 C8.1 3.49,65.09 2.54,66.04 2.54,69.53 R14.1
  pour Top: 66.04,15.24 64.01,17.27 66.04,19.3
  pour Top: 72.39,7.62 74.93,5.08 72.39,5.08
  pour Top (no thermals): 74.93,63.5 74.93,64.77 74.42,65.28 74.42,64.01
  pour Top (no thermals): 39.37,68.58 43.18,64.77 41.15,64.77 39.37,62.99
  pour Top (no thermals): 58.42,3.81 60.2,5.59 61.72,5.59 63.5,3.81
  pour Top (no thermals): 22.86,43.18 25.15,45.47 20.83,45.47 20.83,45.21
  pour Bottom (no thermals): 3.81,57.15 5.59,58.93 5.59,59.94 5.84,60.2 5.84,61.21 5.59,61.21 3.81,59.44
  pour Bottom (no thermals): 26.16,68.07 27.18,68.07 26.67,68.58
  pour Top (no thermals): 64.77,24.13 66.04,25.4 66.04,22.86
  pour Top (no thermals): 33.53,38.35 35.31,38.35 35.81,38.86 36.83,39.88 36.83,35.05
  pour Top (no thermals): 75.18,56.64 75.18,55.88 75.95,55.88
  pour Top: 77.47,55.88 78.23,55.12 78.49,54.86 78.49,53.34 80.01,54.86 80.01,55.88
  pour Top: 66.04,44.96 70.1,44.96 68.07,42.93
ADD_A0  (via drill 0.6)
  Top 0.406: X100.12 50.18,5.73 50.8,6.35 50.8,12.7 52.07,13.97 v60.96,13.97
  Bottom 0.406: U9.1 61.59,14.61 v60.96,13.97
ADD_A1
  Bottom 0.406: U9.2 60.33,15.88 58.42,13.97 45.72,13.97 44.45,12.7 44.45,8.37 X100.15
ADD_A2  (via drill 0.6)
  Top 0.406: X100.16 45.1,5.73 45.72,6.35 45.72,10.16 50.8,15.24 v57.15,15.24
  Bottom 0.406: U9.3 59.05,17.14 v57.15,15.24
CS0_C  (via drill 0.6)
  Top 0.406: v44.45,15.24 39.37,15.24 35.56,11.43 35.56,7.1 X100.24 | R17.1 57.47,18.86 v57.78,18.54
  Bottom 0.406: U9.4 57.78,19.05 v57.78,18.54 57.78,18.41 54.61,15.24 v44.45,15.24
CS1  (via drill 0.6)
  Top 0.406: v15.49,63.5 15.49,55.63 v16.51,54.61
  Bottom 0.406: v15.49,63.5 15.37,63.63 U1.10 15.24,65.84 15.24,68.33 14.48,69.09 5.52,69.09 R14.2 | v16.51,54.61 57.15,54.61 59.05,52.7 U9.14
CS2  (via drill 0.6)
  Top 0.406: v31.75,52.07 v31.75,60.96
  Bottom 0.406: R15.2 23.43,66.36 23.88,66.8 29.21,66.8 30.48,65.53 U2.3 30.48,62.23 v31.75,60.96 | U9.13 57.78,51.44 57.15,52.07 v31.75,52.07
CS3  (via drill 0.6)
  Top 0.406: v44.96,60.71 44.96,51.56 v45.72,50.8 | v44.7,67.31 R10.2
  Bottom 0.406: U9.12 56.52,50.16 55.88,50.8 v45.72,50.8 | v44.96,60.71 45.09,60.83 U3.11 45.09,66.93 v44.7,67.31
DC_LATCH  (via drill 0.6)
  Top 0.406: v63.5,40.64 63.5,39.37 62.23,38.1 v55.37,38.1
  Bottom 0.406: U4.4 65.41,62.87 62.23,59.69 62.23,41.91 v63.5,40.64 | v55.37,38.1 34.29,38.1 33.66,37.47 U$3.9
GND  (via drill 0.6, 0.7)
  Top 0.305: U5.1 78.33,64.36 77.47,63.5 77.47,62.55
  Top 0.406: 77.47,62.55 C23.2 | U6.3 14.4,42.59 14.48,42.67 | 74.36,53.09 73.15,53.09 72.39,53.85 U$1.3 72.39,50.55 v71.88,50.04 | 74.36,53.09 C3.2 | 74.36,53.09 74.68,53.09 74.93,53.34
  Top 0.61: C19.2 C20.2 31.75,68.58 v31.24,68.07 | U6.3 14.4,35.13 15.24,34.29 v17.78,34.29
  Top 0.813: X1.2 83.82,29.21 | 83.82,29.21 82.55,30.48 82.55,34.29 | 82.55,34.29 83.82,35.56 | 83.82,35.56 X2.2 | 83.82,35.56 82.55,36.83 82.55,39.37 83.82,40.64 X2.4 87.63,57.15 | 82.55,34.29 76.2,34.29 v74.93,33.02 v74.93,45.72 | R26.1 R24.1 | v88.65,66.55 88.65,64.84 R26.1 | R18.1 78.55,58.23 v78.74,58.42 81.28,58.42 82.55,57.15 87.63,57.15 | C23.2 v78.74,62.23 | R23.1 72.39,59.69 v73.66,58.42 | R26.1 88.58,58.1 87.63,57.15 | R9.1 84.84,28.19 83.82,29.21
  Top 1.016: C1.2 16.1,43.5 U6.3 | v21.59,72.39 16.89,67.69 v16.64,67.69 16.51,67.82 v8.89,67.82 6.35,67.82 5.4,66.87 C10.2 C9.2 3.81,60.64 3.81,49.53 8.89,44.45 13.72,44.45 14.48,43.69 14.48,42.67 | 13.97,11.43 13.97,8.37 X100.39 | v8.89,11.43 13.97,11.43 | 13.97,11.43 v13.97,20.32
  Bottom 0.406: 71.12,57.15 71.12,58.65 U4.1 | U9.8 52.7,23.5 52.07,22.86 51.12,22.86 R12.1 | U$2.1 76.71,34.8 77.22,34.29 77.22,33.59 C26.2
  Bottom 0.61: U4.1 71.53,56.74 72.39,55.88 C22.2 | C8.2 5.91,67.82 v7.11,67.82 v8.89,67.82 9.65,67.82 10.29,67.18 U1.14 | U2.12 30.48,68.83 v31.24,68.07 34.48,68.07 C21.2 | U3.10 46.35,59.38 C24.2 | R28.2 19.05,20.32 17.78,21.59 17.78,25.4 19.05,26.67 20,26.67 C5.2 | R29.1 19.05,35.56 v17.78,34.29 17.78,30.48 19.05,29.21 20,29.21 C4.2 20.64,29.21 v34.29,29.21 | 36.2,31.11 36.32,30.99 | 37.34,30.99 37.47,31.11 U$3.12 | 37.34,30.99 36.32,30.99 | 36.32,30.99 36.07,30.99 | 36.07,30.99 v34.29,29.21 | v34.29,29.21 37.47,26.04 U$3.13 | C2.2 44.77,25.08 45.21,25.4 47.75,25.4 47.94,25.59 | U10.3 47.94,25.59 | U1.9 v16.64,67.69 | U$3.11 36.2,31.11 | 36.2,31.11 36.07,30.99 | v21.59,72.39 R16.1 | 43.5,26.03 42.3,26.03 37.34,30.99 | U9.8 52.7,24.77 | 52.7,24.77 52.07,25.4 48.13,25.4 47.94,25.59 | 52.7,24.77 52.7,27.05 53.09,27.43 60.2,27.43 60.96,26.67 63.18,26.67 C25.1
  Bottom 0.813: C26.2 v74.93,33.02 74.93,27.94 73.98,26.99 C25.1 | R26.1 88.58,66.48 v88.65,66.55 | R21.2 R20.2 R19.2 | R30.1 43.5,26.03 C2.2 | v78.74,62.23 77.72,62.23 77.22,61.72 77.22,58.93 77.72,58.42 v78.74,58.42 v73.66,58.42 73.03,59.05 U4.1 | v74.93,45.72 74.93,46.99 v71.88,50.04
  Bottom 1.016: C18.1 C17.1 C16.1 C15.1 C14.2 C13.2 C12.2 C11.2 22.86,78.42 | 22.86,78.42 23.81,78.42 | 23.81,78.42 24.13,78.74 SV1.9 | 23.81,78.42 C6.1 C7.2 33.97,78.42 v34.29,78.74 | v34.29,78.74 SV2.3 SV3.2 | C4.2 v20.32,27.94 C5.2 | R16.1 23.18,78.1 22.86,78.42 | v34.29,78.74 34.61,78.74 R21.2 | R19.2 37.15,68.58 | 37.15,68.58 C21.2 | 37.15,68.58 37.15,68.26 38.1,67.31 38.1,60.96 40.64,58.42 C24.2 | 19.05,20.32 v13.97,20.32 | X100.6 57.05,4.98 54.61,2.54 48.26,2.54 46.89,3.91 X100.14 46.89,3.71 45.72,2.54 40.64,2.54 39.27,3.91 X100.20 39.27,3.71 38.1,2.54 27.94,2.54 26.57,3.91 X100.30 26.57,3.71 25.4,2.54 22.86,2.54 21.49,3.91 X100.34 21.49,3.71 20.32,2.54 7.62,2.54 3.81,6.35 3.81,8.89 6.35,11.43 v8.89,11.43
  other vias: 50.8,46.99 50.8,44.45 50.8,41.91 43.18,34.29 50.8,34.29 50.8,31.75 62.23,34.29 62.23,33.02 63.5,20.32 41.91,41.91 41.91,44.45 41.91,46.99 34.29,46.99 34.29,44.45 10.16,31.75 10.16,26.67 80.01,21.59 80.01,16.51 27.94,48.26 13.97,52.07 66.04,49.53 80.01,49.53 25.4,76.2 35.56,60.96 34.29,73.66 39.37,19.05 39.37,17.53 39.37,20.57 40.64,26.92 63.75,14.48
  pour Bottom (rank 6): 1.27,1.27 90.17,1.27 90.17,85.09 1.27,85.09
  pour Top (rank 6): 1.27,1.27 90.17,1.27 90.17,85.09 1.27,85.09
GS_LATCH  (via drill 0.6)
  Top 0.305: U5.3 81.66,65.66 83.82,63.5 v83.82,61.47
  Top 0.406: v55.37,36.83 64.77,36.83 66.04,38.1 v66.04,40.64
  Bottom 0.406: v55.37,36.83 35.56,36.83 34.92,36.2 U$3.10 | v66.04,40.64 71.12,40.64 72.39,41.91 80.01,41.91 83.82,45.72 v83.82,61.47
GS_MODE  (via drill 0.6)
  Top 0.305: R26.2 83.83,67.61 U5.6 83.77,67.61 86.36,65.02
  Top 0.406: 86.36,65.02 86.36,64.77 87.12,64.01 v87.12,62.23 | v55.37,39.37 v60.96,39.37
  Bottom 0.406: v55.37,39.37 33.02,39.37 32.38,38.73 U$3.8 | v60.96,39.37 71.12,39.37 72.39,40.64 81.28,40.64 87.12,46.48 v87.12,62.23
LED1  (via drill 0.6)
  Top 0.305: U5.22 71.3,68.25 69.6,66.55 v69.6,64.26
  Bottom 0.406: U4.5 69.6,64.14 v69.6,64.26 64.01,64.26 62.23,66.04 62.23,73.66 SV11.3
LED2  (via drill 0.6)
  Top 0.305: U5.21 70.69,68.91 68.07,66.29 v68.07,65.53
  Top 0.406: SV11.4 68.58,80.01 68.58,77.47 63.5,72.39 63.5,67.06 65.02,65.53 v68.07,65.53
  Bottom 0.406: U4.6 68.2,65.41 v68.07,65.53
LED3  (via drill 0.6)
  Top 0.305: U5.20 69.8,69.55 v67.06,66.8
  Top 0.406: SV11.5 69.85,77.47 64.77,72.39 64.77,67.31 65.28,66.8 v67.06,66.8
  Bottom 0.406: U4.7 67.44,66.67 v67.06,66.8
LED4  (via drill 0.6)
  Top 0.305: 69.44,70.21 U5.19 67.41,70.21 66.29,69.09 v66.29,68.07
  Bottom 0.406: U4.8 66.42,67.94 v66.29,68.07 64.01,70.36 64.01,74.17 66.04,76.2 70.87,76.2 71.12,76.45 71.12,80.01 SV11.6
LED5  (via drill 0.6)
  Top 0.305: U5.18 v66.04,70.87
  Bottom 0.406: U4.9 67.69,69.22 v66.04,70.87 65.53,71.37 65.53,73.91 66.8,75.18 71.12,75.18 72.39,76.45 SV11.7
LED6  (via drill 0.6)
  Top 0.305: U5.17 67.44,71.5 v66.8,72.14
  Bottom 0.406: SV11.8 73.66,80.01 73.66,74.93 72.9,74.17 67.56,74.17 66.8,73.41 v66.8,72.14 68.45,70.48 U4.10
LED7  (via drill 0.6)
  Top 0.305: SV11.9 74.68,78.49 74.68,72.64 74.19,72.16 U5.16 68.56,72.16 v68.07,72.64
  Bottom 0.406: v68.07,72.64 68.45,72.26 68.58,72.14 68.96,71.75 U4.11
LED8  (via drill 0.6)
  Top 0.305: U5.15 69.95,72.8 v69.6,73.15
  Bottom 0.406: SV11.10 76.2,80.01 76.2,76.2 73.03,73.03 U4.12 69.72,73.03 v69.6,73.15 69.85,72.9
LED9  (via drill 0.6)
  Top 0.305: U5.14 80.42,72.8 81.28,73.66 v81.28,74.42
  Bottom 0.406: SV11.11 77.47,74.93 79.38,73.03 U4.13 81.28,73.43 v81.28,74.42
LED10  (via drill 0.6)
  Top 0.305: SV11.12 76.2,80.01 76.2,73.66 77.7,72.16 U5.13 81.81,72.16 82.8,73.15 v82.8,74.42
  Bottom 0.406: U4.14 82.17,71.75 82.8,72.39 v82.8,74.42
LED11  (via drill 0.6)
  Top 0.305: U5.12 82.93,71.5 84.84,73.41 v84.84,74.42
  Bottom 0.406: SV11.13 80.01,77.47 81.53,75.95 84.07,75.95 84.84,75.18 v84.84,74.42 84.84,73.41 81.92,70.48 U4.15
LED12  (via drill 0.6)
  Top 0.305: U5.11 83.82,70.87 v86.36,73.41
  Top 0.406: SV11.14 81.28,80.01 81.28,77.47 82.8,75.95 85.85,75.95 86.36,75.44 v86.36,73.41
  Bottom 0.406: v86.36,73.41 82.17,69.22 U4.16
LED13  (via drill 0.6)
  Top 0.305: U5.10 84.68,70.21 v86.36,71.88
  Bottom 0.406: U4.17 82.42,67.94 v86.36,71.88 88.9,74.42 88.9,76.2 87.63,77.47 83.82,77.47 SV11.15
LED14  (via drill 0.6)
  Top 0.305: U5.9 85.55,69.55 v86.36,70.36
  Top 0.406: v86.36,70.36 88.9,72.9 88.9,77.47 86.36,80.01 83.82,80.01 SV11.16
  Bottom 0.406: v86.36,70.36 82.68,66.67 U4.18
LED15  (via drill 0.6)
  Top 0.305: U5.8 v86.79,68.91
  Bottom 0.406: U4.19 83.19,65.41 86.69,68.91 | 86.69,68.91 90.17,72.39 90.17,77.47 88.9,78.74 SV11.17 | v86.79,68.91 86.69,68.91
LED16  (via drill 0.6)
  Top 0.305: U5.7 85.17,68.25 v86.36,67.06
  Top 0.406: SV11.18 87.38,81.28 90.17,78.49 90.17,70.87 v86.36,67.06
  Bottom 0.406: v86.36,67.06 83.44,64.14 U4.20
LED_CLK  (via drill 0.6)
  Top 0.406: U6.2 v12.7,39.37
  Bottom 0.406: v12.7,39.37 25.4,39.37 27.3,37.47 U$3.4
LED_SDO  (via drill 0.6)
  Top 0.406: U6.1 11,38.53 v11.43,38.1
  Bottom 0.406: v11.43,38.1 24.13,38.1 26.04,36.2 U$3.3
MISO  (via drill 0.6)
  Top 0.406: v27.94,59.69 v30.48,59.69 | v41.15,60.71 40.13,59.69 40.13,53.85 43.18,50.8 | v46.99,31.75 46.99,46.99 43.81,50.16 43.18,50.8 | v33.02,58.42 33.02,52.07 v34.29,50.8 | v39.37,50.8 43.18,50.8
  Bottom 0.406: U1.12 12.83,60.83 13.97,59.69 SV9.2 v27.94,59.69 | U3.14 41.27,60.83 v41.15,60.71 | v46.99,31.75 U10.2 | v30.48,59.69 31.75,59.69 v33.02,58.42 | v34.29,50.8 v39.37,50.8
  pour Top (no thermals): 40.64,50.8 41.15,51.31 41.4,51.56 41.4,52.58 43.18,50.8
MISO0
  Bottom 0.406: U10.4 47.94,21.27 43.18,16.51 43.18,7.67 42.47,6.96 38.04,6.96 X100.21
MOSI  (via drill 0.6)
  Top 0.305: U5.5 81.64,66.95 85.6,62.99 v85.6,61.72
  Top 0.406: v85.6,55.63 82.04,52.07 v81.79,52.07 | v42.42,60.71 42.42,56.13 v42.67,55.88 | v25.4,60.96 v25.4,55.88 v25.4,53.34 | v60.96,55.88 v63.5,58.42
  Bottom 0.406: U4.2 71.4,60.2 70.36,60.2 69.85,59.69 64.77,59.69 v63.5,58.42 63.5,53.34 64.77,52.07 v81.79,52.07 | v85.6,55.63 v85.6,61.72 | U1.11 14.1,62.1 15.24,60.96 17.78,60.96 19.05,62.23 SV9.1 26.67,62.23 | U2.5 27.94,63.5 26.67,62.23 | v60.96,55.88 v42.67,55.88 v25.4,55.88 | U3.13 42.55,60.83 v42.42,60.71 | v25.4,60.96 26.67,62.23 | v25.4,53.34 25.65,53.09 27.94,53.09 31.11,49.91 U$3.7
MOSI0
  Bottom 0.406: X100.19 39.27,8.99 32.38,15.88 U$3.17
MOSI1  (via drill 0.6)
  Top 0.406: v16.51,17.78 v16.51,15.24
  Bottom 0.406: v16.51,17.78 23.37,17.78 27.3,21.72 U$3.21 | X100.38 15.24,6.86 15.24,13.97 v16.51,15.24
N$1
  Top 0.61: SV1.1 R1.1
N$2
  Top 0.61: SV1.2 R2.1
N$3
  Top 0.61: SV1.3 R3.1
N$4
  Top 0.61: SV1.4 R4.1
N$5
  Top 0.61: SV1.5 R5.1
N$6
  Top 0.61: SV1.6 R6.1
N$7
  Top 0.61: SV1.7 R7.1
N$8
  Top 0.61: SV1.8 R8.1
N$9  (via drill 0.6)
  Top 0.61: C18.2 v3.81,74.93
  Bottom 0.406: v3.81,74.93 6.35,72.39 7.37,72.39 7.75,72.01 U1.1
  Bottom 0.61: v3.81,74.93 C18.2
N$10  (via drill 0.6)
  Top 0.61: v6.35,74.93 C17.2
  Bottom 0.406: U1.2 9.02,72.26 v6.35,74.93
  Bottom 0.61: C17.2 v6.35,74.93
N$11  (via drill 0.6)
  Top 0.61: C16.2 v8.89,74.93
  Bottom 0.406: U1.3 10.29,73.53 v8.89,74.93
  Bottom 0.61: v8.89,74.93 C16.2
N$12  (via drill 0.6)
  Top 0.61: v11.43,74.93 C15.2
  Bottom 0.406: v11.43,74.93 11.43,71.07 U1.4
  Bottom 0.61: C15.2 v11.43,74.93
N$13  (via drill 0.6)
  Top 0.61: C14.1 v13.97,74.93
  Bottom 0.406: U1.5 12.83,73.79 v13.97,74.93
  Bottom 0.61: v13.97,74.93 C14.1
N$14  (via drill 0.6)
  Top 0.61: v16.51,74.93 C13.1
  Bottom 0.406: U1.6 14.1,72.52 v16.51,74.93
  Bottom 0.61: C13.1 v16.51,74.93
N$15  (via drill 0.6)
  Top 0.61: C12.1 v19.05,74.93
  Bottom 0.406: U1.7 15.37,72.52 16.51,73.66 17.78,73.66 v19.05,74.93
  Bottom 0.61: v19.05,74.93 C12.1
N$16  (via drill 0.6)
  Top 0.61: v21.59,74.93 C11.1
  Bottom 0.406: U1.8 16.64,72.01 17.02,72.39 19.05,72.39 v21.59,74.93
  Bottom 0.61: C11.1 v21.59,74.93
N$17  (via drill 0.6)
  Top 0.61: C6.2 v29.21,74.93
  Bottom 0.406: U2.14 33.02,72.9 32.51,73.41 29.97,73.41 29.21,74.17 v29.21,74.93
  Bottom 0.61: v29.21,74.93 C6.2
N$18  (via drill 0.6)
  Top 0.406: R33.1 57.47,25.59 56.9,26.16 v55.88,26.16
  Bottom 0.406: U9.6 55.24,25.53 55.5,25.78 v55.88,26.16
N$35
  Bottom 0.406: U10.1 46.04,28.57 R30.2
N$36
  Bottom 0.406: U$3.19 29.84,19.68 25.4,15.24 20.32,15.24 16.51,11.43 16.51,8.37 X100.37
N$37
  Top 0.61: SV2.1 R31.1
N$38
  Top 0.61: SV2.2 R32.1
N$39  (via drill 0.6)
  Top 0.406: v27.94,72.9 29.72,72.9 v31.75,74.93
  Top 0.61: v31.75,74.93 C7.1
  Bottom 0.406: U2.10 v27.94,72.9
  Bottom 0.61: C7.1 v31.75,74.93
N$42  (via drill 0.6)
  Top 0.406: X100.31 24.03,10.06 33.66,19.68 v33.66,21.31
  Bottom 0.406: U$3.16 v33.66,21.31
N$43
  Top 0.61: LED1.K 85.09,9.98 R9.2
N$44
  Bottom 0.406: U$2.9 82.96,37.24 83.82,38.1 X2.3 87.58,38.05 U$2.8
N$67
  Bottom 0.406: U$2.10 82.96,36.42 83.82,35.56 | X2.1 86.36,33.02 83.82,35.56 | U$2.11 81.33,35.61 81.28,35.56 83.82,35.56
N$76  (via drill 0.6)
  Top 0.61: v8.89,62.23 C9.1 C10.1 8.13,64.77 v8.89,64.01
  Bottom 0.61: U1.15 9.02,64.14 v8.89,64.01 | R11.1 7.62,60.96 v8.89,62.23
N$77  (via drill 0.6)
  Top 0.61: R13.1 C19.1 C20.1 35.24,70.42 33.53,72.14 v30.99,72.14
  Bottom 0.406: U2.13 31.75,71.63 31.24,72.14 v30.99,72.14 29.72,72.14 29.21,71.63 U2.11
N$78
  Bottom 0.406: U2.8 25.4,72.07 R16.2
N$80  (via drill 0.7)
  Top 0.61: v78.99,60.2 77.66,60.2 R18.2
  Bottom 0.61: U4.23 79.12,60.33 v78.99,60.2
N$81
  Top 0.305: U5.25 71.63,66.29 70.78,65.44 70.78,57.77 U$1.2
N$82  (via drill 0.6)
  Top 0.406: X100.32 24.03,6.25 25.4,7.62 25.4,8.89 v34.29,17.78
  Bottom 0.406: U$3.15 34.92,18.41 v34.29,17.78
N$83
  Bottom 0.406: U3.15 41.27,70.99 40.89,70.61 39.56,70.61 R19.1
N$84
  Bottom 0.406: U3.16 42.55,73.53 41.91,74.17 39.56,74.17 R20.1
N$85
  Bottom 0.406: U3.17 43.81,74.3 41.91,76.2 R21.1
N$86  (via drill 0.6)
  Top 0.406: v35.56,16.51 v31.75,12.7
  Bottom 0.406: X100.33 21.49,11.33 22.86,12.7 v31.75,12.7 | U$3.14 36.2,17.14 v35.56,16.51
N$89
  Bottom 0.406: U4.21 84.78,62.87 R22.1
N$90
  Bottom 0.406: R12.2 54.93,20.64 56.52,22.23 U9.5
N$93
  Top 0.305: U5.27 72.11,65 71.88,64.77 71.88,62.42
  Top 0.406: 71.88,62.42 R23.2
N$94
  Top 0.305: U5.2 81.05,65 82.04,64.01 82.04,61.47 83.82,59.69 R24.2
N$98
  Bottom 0.406: U$3.22 26.04,22.23 24.13,20.32 R28.1
N$99
  Bottom 0.61: R29.2 24.13,35.56 24.77,34.92 U$3.2
PA0
  Bottom 0.406: U3.21 48.9,74.3 48.26,74.93 45.72,74.93 SV3.3
PA1
  Bottom 0.406: U3.22 50.16,74.8 48.77,76.2 46.99,76.2 SV3.5
PA2
  Bottom 0.406: U3.23 51.44,75.06 49.28,77.22 48.51,77.22 SV3.7
PA3
  Bottom 0.406: U3.24 52.7,75.56 SV3.9
PA4
  Bottom 0.406: U3.25 53.98,76.83 SV3.11
PA5
  Bottom 0.406: U3.26 55.24,78.11 SV3.13
PA6
  Bottom 0.406: U3.27 56.52,74.04 57.15,74.68 SV3.15
PA7
  Bottom 0.406: U3.28 57.78,73.03 59.69,74.93 SV3.17
PB0  (via drill 0.6)
  Top 0.406: v59.69,72.39 59.69,76.2 60.96,77.47 60.96,80.01 SV3.18
  Bottom 0.406: U3.1 57.78,65.41 59.69,67.31 v59.69,72.39
PB1  (via drill 0.6)
  Top 0.406: v58.42,68.07 58.42,80.01 SV3.16
  Bottom 0.406: U3.2 56.52,66.17 v58.42,68.07
PB2  (via drill 0.6)
  Top 0.406: v55.88,67.56 55.88,80.01 SV3.14
  Bottom 0.406: U3.3 55.24,66.93 v55.88,67.56
PB3  (via drill 0.6)
  Top 0.406: v54.61,68.58 54.61,76.2 53.34,77.47 53.34,80.01 SV3.12
  Bottom 0.406: U3.4 53.98,67.94 v54.61,68.58
PB4  (via drill 0.6)
  Top 0.406: v52.58,68.58 52.58,75.69 50.8,77.47 50.8,80.01 SV3.10
  Bottom 0.406: U3.5 52.7,68.45 v52.58,68.58
PB5  (via drill 0.6)
  Top 0.406: v50.8,68.58 50.8,74.93 48.26,77.47 48.26,80.01 SV3.8
  Bottom 0.406: U3.6 51.44,67.94 v50.8,68.58
PB6  (via drill 0.6)
  Top 0.406: v49.53,67.31 49.53,73.66 45.72,77.47 45.72,80.01 SV3.6
  Bottom 0.406: U3.7 50.16,66.67 v49.53,67.31
PB7  (via drill 0.6)
  Top 0.406: v48.26,66.04 48.26,72.39 43.18,77.47 43.18,80.01 SV3.4
  Bottom 0.406: U3.8 48.9,65.41 v48.26,66.04
POUT1  (via drill 0.6)
  Top 0.406: v72.39,25.4 v72.39,29.21
  Bottom 0.406: X100.7 54.51,8.79 57.15,11.43 66.04,11.43 72.39,17.78 v72.39,25.4 | U$2.3 73.25,36.42 72.39,35.56 v72.39,29.21
POUT2  (via drill 0.6)
  Top 0.406: v71.12,29.21 v71.12,25.4
  Bottom 0.406: U$2.6 74.42,38.86 71.12,35.56 v71.12,29.21 | v71.12,25.4 71.12,19.05 64.77,12.7 49.53,12.7 46.99,10.16 46.99,8.37 X100.13
RESET  (via drill 0.6, 0.7)
  Top 0.61: v54.1,26.16 54.1,57.66 46.99,64.77 v46.99,68.58
  Bottom 0.61: U9.7 53.98,26.04 v54.1,26.16 | U3.18 45.09,70.48 v46.99,68.58
SCLK  (via drill 0.6)
  Top 0.305: U5.4 78.23,66.29 77.98,66.04 77.98,65.28 77.47,64.77 76.45,64.77 v76.2,64.52
  Top 0.406: v67.82,61.47 v61.98,61.47 | v43.69,60.71 v43.69,56.9 | v28.7,56.9 v28.7,50.8
  Bottom 0.406: U1.13 11.56,58.29 12.7,57.15 SV9.3 27.94,57.15 | 27.94,57.15 29.21,58.42 | 29.21,58.42 U2.4 | 27.94,57.15 30.48,57.15 | 29.21,58.42 30.48,57.15 | v76.2,64.52 76.2,62.23 75.56,61.59 U4.3 68.2,61.59 v67.82,61.47 | v61.98,61.47 57.4,56.9 v43.69,56.9 30.73,56.9 | U3.12 43.81,60.83 v43.69,60.71 | 30.73,56.9 30.48,57.15 | 30.73,56.9 v28.7,56.9 | v28.7,50.8 29.84,49.4 U$3.6
  pour Bottom (no thermals): 30.73,56.9 27.94,57.15 29.21,58.42
SCLK0
  Bottom 0.406: X100.23 34.19,12.55 31.11,15.37 U$3.18
SCLK1
  Bottom 0.406: X100.40 12.7,6.86 12.7,13.97 15.24,16.51 24.13,16.51 28.57,20.95 U$3.20
VCC
  Bottom 0.406: U$2.7 79.5,38.86 78.74,38.1 U$2.TP 78.74,35.56 79.5,34.8 U$2.12
  Bottom 0.813: X1.1 83.82,26.67 80.01,30.48 80.01,32.7 C26.1
  Bottom 1.016: C26.1 79.69,34.61 78.74,35.56

### Text on the board
tPlace: LED | GPIO | ADC | DAC | Status | Power | RaspiIO | Eval